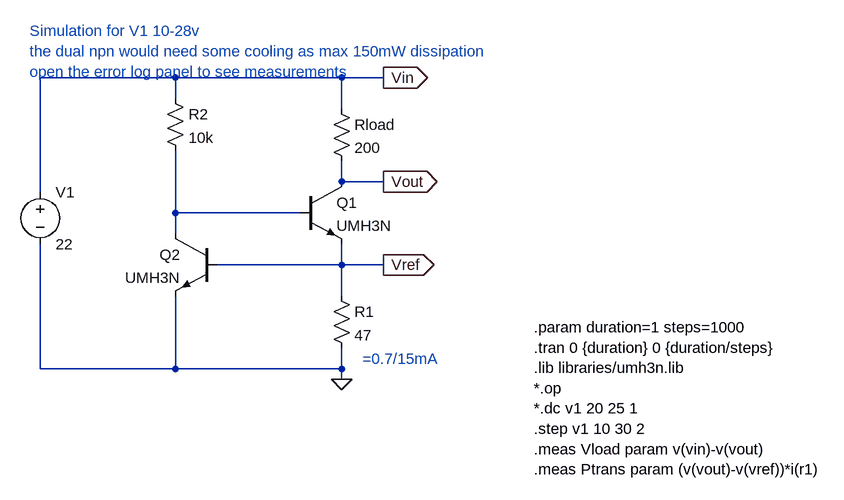
[diagram p0: schematic constantcurrent.asc]
constantcurrent.asc, the LTspice schematic file:
Version 4
SHEET 1 1108 696
WIRE 32 144 -176 144
WIRE 288 144 32 144
WIRE 352 144 288 144
WIRE 32 176 32 144
WIRE 288 192 288 144
WIRE 288 304 288 272
WIRE 352 304 288 304
WIRE -176 320 -176 144
WIRE 32 352 32 256
WIRE 224 352 32 352
WIRE 32 384 32 352
WIRE 288 432 288 400
WIRE 288 432 96 432
WIRE 352 432 288 432
WIRE 288 480 288 432
WIRE -176 592 -176 400
WIRE 32 592 32 480
WIRE 32 592 -176 592
WIRE 288 592 288 560
WIRE 288 592 32 592
WIRE 288 608 288 592
FLAG 288 608 0
FLAG 352 304 Vout
IOPIN 352 304 Out
FLAG 352 432 Vref
IOPIN 352 432 Out
FLAG 352 144 Vin
IOPIN 352 144 Out
SYMBOL npn 224 304 R0
SYMATTR InstName Q1
SYMATTR Value UMH3N
SYMATTR Prefix X
SYMBOL Res 272 464 R0
SYMATTR InstName R1
SYMATTR Value 47
SYMBOL Res 16 160 R0
SYMATTR InstName R2
SYMATTR Value 10k
SYMBOL npn 96 384 M0
SYMATTR InstName Q2
SYMATTR Value UMH3N
SYMATTR Prefix X
SYMBOL Voltage -176 304 R0
SYMATTR InstName V1
SYMATTR Value 22
SYMBOL Res 272 176 R0
SYMATTR InstName Rload
SYMATTR Value 200
TEXT 584 528 Left 2 !.param duration=1 steps=1000\n.tran 0 {duration} 0 {duration/steps}\n.lib libraries/umh3n.lib\n*.op\n*.dc v1 20 25 1\n.step v1 10 30 2\n.meas Vload param v(vin)-v(vout)\n.meas Ptrans param (v(vout)-v(vref))*i(r1)
TEXT 320 576 Left 2 ;=0.7/15mA
TEXT -192 72 Left 2 ;Simulation for V1 10-28v\nthe dual npn would need some cooling as max 150mW dissipation\nopen the error log panel to see measurements

The netlist it stands for:
* constantcurrent.asc
XQ1 Vout N001 Vref UMH3N  ; pins C B E
R1 Vref 0 47
R2 Vin N001 10k
XQ2 N001 Vref 0 UMH3N  ; pins C B E
V1 Vin 0 22
Rload Vin Vout 200
.param duration=1 steps=1000
.tran 0 {duration} 0 {duration/steps}
.lib libraries/umh3n.lib
*.op
*.dc v1 20 25 1
.step v1 10 30 2
.meas Vload param v(vin)-v(vout)
.meas Ptrans param (v(vout)-v(vref))*i(r1)
* =0.7/15mA
* Simulation for V1 10-28v
* the dual npn would need some cooling as max 150mW dissipation
* open the error log panel to see measurements
.backanno
.end